# EAGLE schematic LBSS (EAGLE 9.6.2)
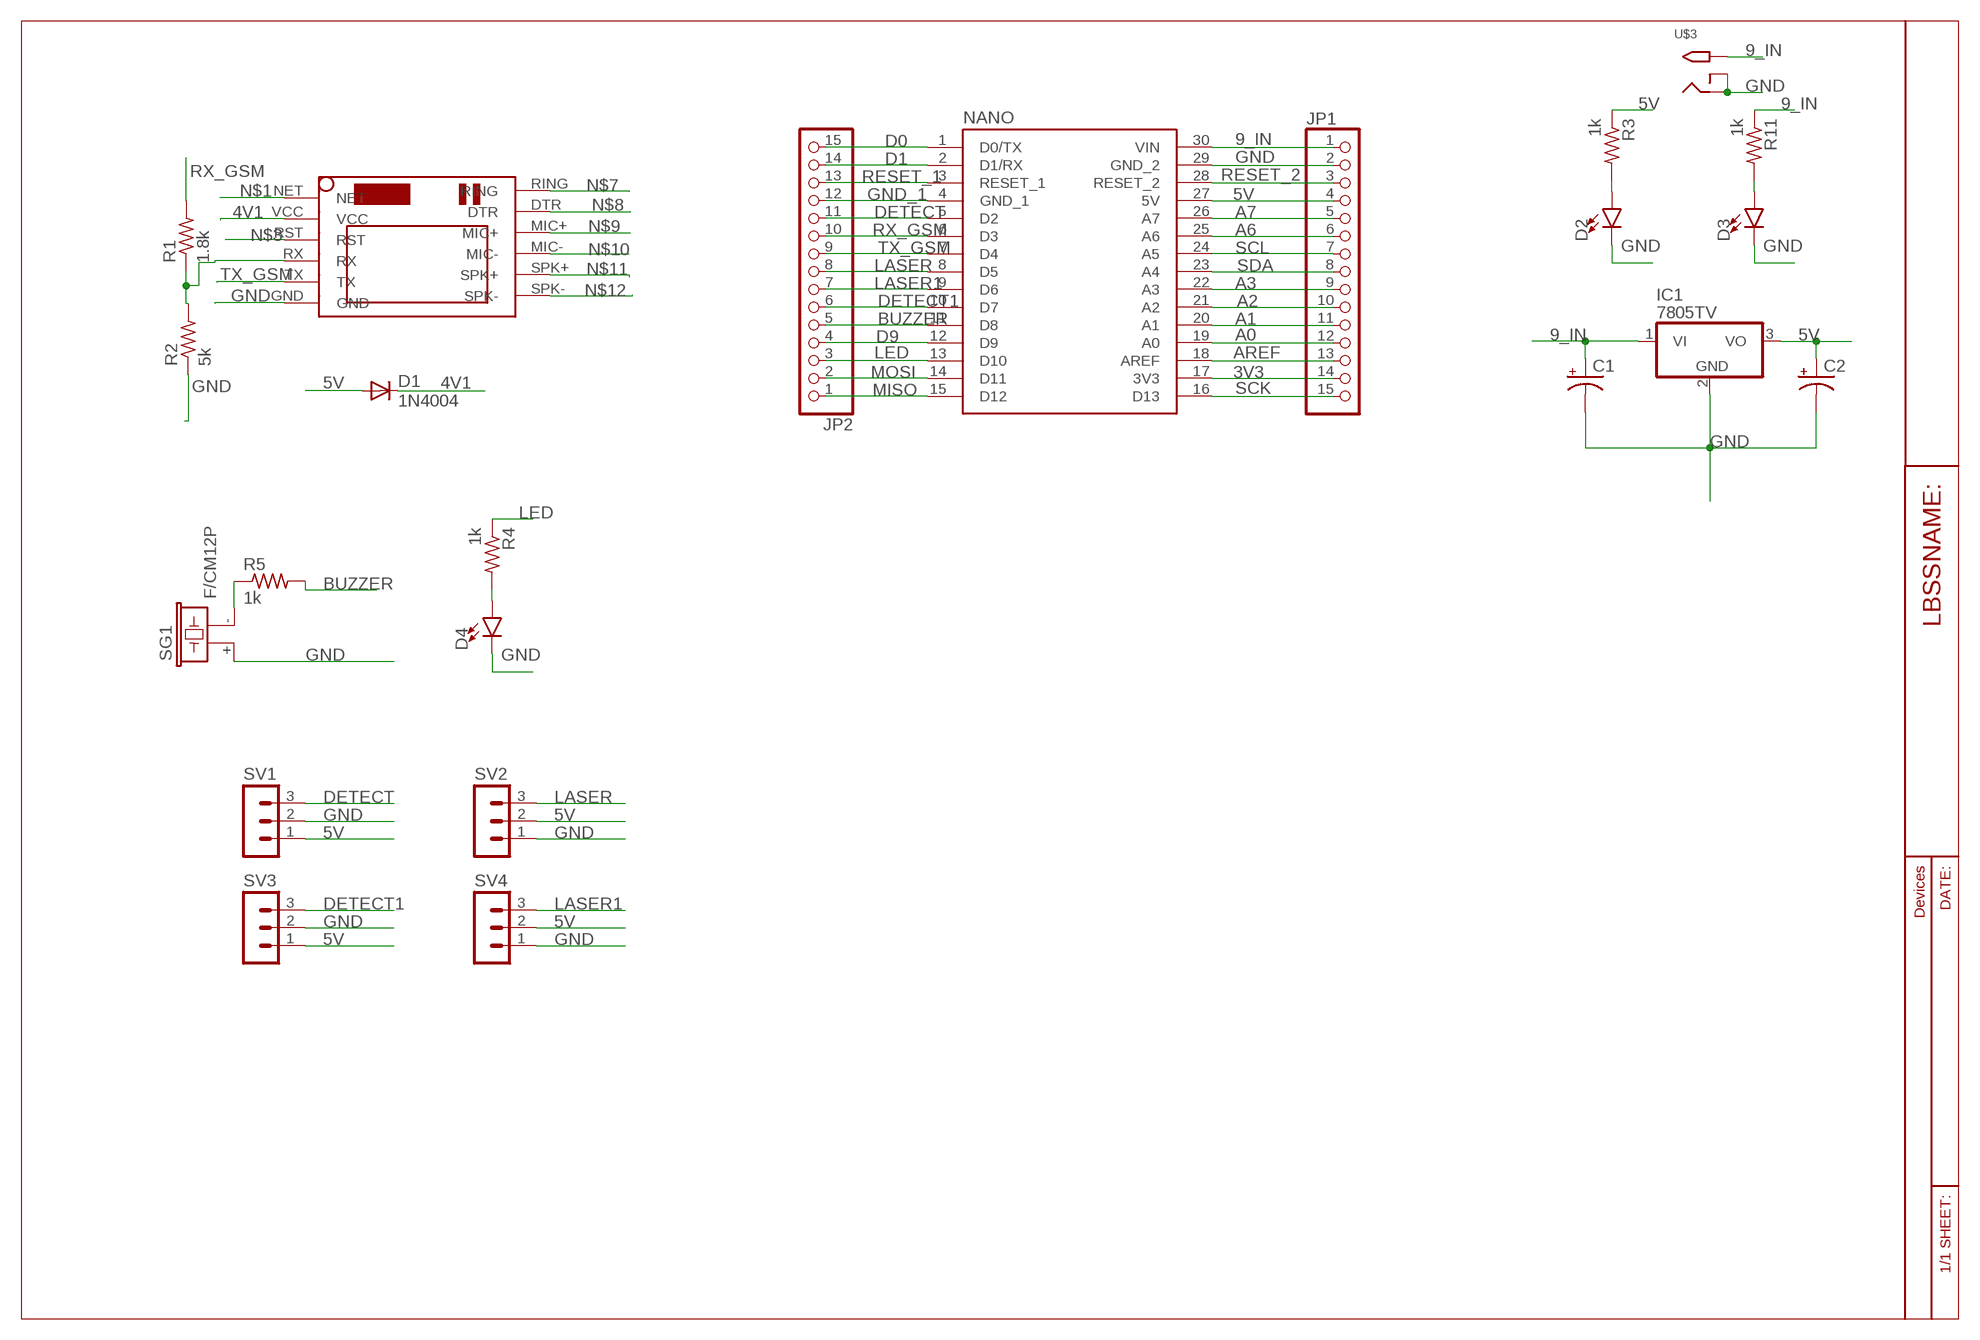
[diagram p0: schematic, sheet 1]

## Parts
C1  CPOL-USE3.5-8  [E3,5-8]
C2  CPOL-USE3.5-8  [E3,5-8]
D1  1N4004  [DO41-10]
D2  LED3MM  [LED_3MM]
D3  LED3MM  [LED_3MM]
D4  LED3MM  [LED_3MM]
IC1  7805TV  [TO220V]
JP1  PINHD-1X15  [1X15]
JP2  PINHD-1X15  [1X15]
NANO  A000005  [MODULE_A000005]
R1  1.8k  R-US_0207/10  [0207/10]
R2  5k  R-US_0207/10  [0207/10]
R3  1k  R-US_M0805  [M0805]
R4  1k  R-US_M0805  [M0805]
R5  1k  R-US_M0805  [M0805]
R11  1k  R-US_M0805  [M0805]
SG1  F/CM12P  [F/CM12P]
SV1  MA03-1  [MA03-1]
SV2  MA03-1  [MA03-1]
SV3  MA03-1  [MA03-1]
SV4  MA03-1  [MA03-1]
U$1  SIM800LMODULE  [SIM800LMODULE]
U$3  2.1MMJACKTHM  [PJ-102A]

## Nets
3V3: JP1.14 NANO.17(3V3)
4V1: D1.C U$1.VCC
5V: C2.+ D1.A IC1.3(VO) JP1.4 NANO.27(5V) R3.1 SV1.1 SV2.2 SV3.1 SV4.2
9_IN: C1.+ IC1.1(VI) JP1.1 NANO.30(VIN) R11.1 U$3.TIP
A0: JP1.12 NANO.19(A0)
A1: JP1.11 NANO.20(A1)
A2: JP1.10 NANO.21(A2)
A3: JP1.9 NANO.22(A3)
A6: JP1.6 NANO.25(A6)
A7: JP1.5 NANO.26(A7)
AREF: JP1.13 NANO.18(AREF)
BUZZER: JP2.5 NANO.11(D8) R5.2
D0: JP2.15 NANO.1(D0/TX)
D1: JP2.14 NANO.2(D1/RX)
D9: JP2.4 NANO.12(D9)
DETECT: JP2.11 NANO.5(D2) SV1.3
DETECT1: JP2.6 NANO.10(D7) SV3.3
GND: C1.- C2.- D2.K(C) D3.K(C) D4.K(C) IC1.2(GND) JP1.2 NANO.29(GND_2) R2.1 SG1.+ SV1.2 SV2.1 SV3.2 SV4.1 U$1.GND U$3.RING U$3.RING_SW
GND_1: JP2.12 NANO.4(GND_1)
LASER: JP2.8 NANO.8(D5) SV2.3
LASER1: JP2.7 NANO.9(D6) SV4.3
LED: JP2.3 NANO.13(D10) R4.1
MISO: JP2.1 NANO.15(D12)
MOSI: JP2.2 NANO.14(D11)
N$1: U$1.NET
N$2: D3.A R11.2
N$3: U$1.RST
N$4: R1.1 R2.2 U$1.RX
N$5: D2.A R3.2
N$6: R5.1 SG1.-
N$7: U$1.RING
N$8: U$1.DTR
N$9: U$1.MIC+
N$10: U$1.MIC-
N$11: U$1.SPK+
N$12: U$1.SPK-
N$13: D4.A R4.2
RESET_1: JP2.13 NANO.3(RESET_1)
RESET_2: JP1.3 NANO.28(RESET_2)
RX_GSM: JP2.10 NANO.6(D3) R1.2
SCK: JP1.15 NANO.16(D13)
SCL: JP1.7 NANO.24(A5)
SDA: JP1.8 NANO.23(A4)
TX_GSM: JP2.9 NANO.7(D4) U$1.TX

## Library data of the parts
C1 C2 = adafruit:CPOL-US: POLARIZED CAPACITOR, American symbol
D1 = adafruit:1N4004: DIODE General purpose 1N400x type rectifier (With bigger pads) http://www.ladyada.net/library/pcb/eaglelibrary.html
D2-D4 = SparkFun-LED:LED: LED (Generic) Standard schematic elements and footprints for 5mm, 3mm, 1206, and 0603 sized LEDs. Generic LEDs with no color specified.; PROD_ID: DIO-08794
IC1 = linear:78*: Positive VOLTAGE REGULATOR Source: http://cache.national.com/ds/LM/LM78L05.pdf http://www.fairchildsemi.com/ds/LM/LM7805.pdf
JP1 JP2 = adafruit:PINHD-1X15: PIN HEADER
NANO = A000005:A000005: CLOCK SAW OSCILLATOR SEAM7050 T& Check prices <https://pricing.snapeda.com/parts/A000005/Arduino/view-part?ref=eda>; AVAILABILITY: Good; DESCRIPTION: ATmega328 Arduino Nano AVR® ATmega AVR MCU 8-Bit Embedded Evaluation Board; MF: Arduino; MP: A000005; PACKAGE: None; PRICE: None; PURCHASE-URL: https://pricing.snapeda.com/search/part/A000005/?ref=eda
R1 R2 = rcl:R-US_: RESISTOR, American symbol; SPICEPREFIX: R
R3-R5 R11 = adafruit:R-US_: RESISTOR, American symbol
SG1 = buzzer:F/CM12P: BUZZER Source: Buerklin; OC_FARNELL: unknown; OC_NEWARK: unknown
SV1-SV4 = con-lstb:MA03-1: PIN HEADER; OC_FARNELL: unknown; OC_NEWARK: unknown
U$1 = SIM800LMODULE:SIM800LMODULE: SIM800L Module
U$3 = adafruit:2.1MMJACK: 2.1mm x 5.5mm THM DC jack with internal switch. Digikey part #PJ-102A, 4UCON part #05537 2.1mm x 5.5mm SMT DC jack with internal switch. Digikey part #PJ-002A-SMT, 4UCON part #03267 By microbuilder.eu & adafruit.com